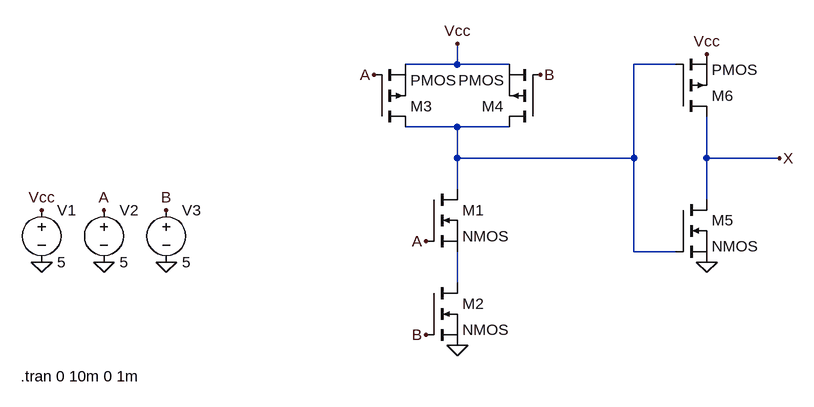
[diagram p0: schematic and.asc]
and.asc, the LTspice schematic file:
Version 4.1
SHEET 1 1056 680
WIRE 528 -128 528 -160
WIRE 528 -128 448 -128
WIRE 608 -128 528 -128
WIRE 864 -128 800 -128
WIRE 528 -32 448 -32
WIRE 608 -32 528 -32
WIRE 528 16 528 -32
WIRE 800 16 800 -128
WIRE 800 16 528 16
WIRE 912 16 912 -48
WIRE 1024 16 912 16
WIRE 528 64 528 16
WIRE 912 80 912 16
WIRE 800 160 800 16
WIRE 864 160 800 160
WIRE 528 208 528 160
FLAG -112 176 0
FLAG -16 176 0
FLAG 80 176 0
FLAG -112 96 Vcc
FLAG -16 96 A
FLAG 80 96 B
FLAG 528 304 0
FLAG 528 -160 Vcc
FLAG 400 -112 A
FLAG 480 144 A
FLAG 480 288 B
FLAG 656 -112 B
FLAG 912 -144 Vcc
FLAG 912 176 0
FLAG 1024 16 X
SYMBOL voltage -112 80 R0
WINDOW 123 0 0 Left 0
WINDOW 39 0 0 Left 0
SYMATTR InstName V1
SYMATTR Value 5
SYMBOL voltage -16 80 R0
WINDOW 123 0 0 Left 0
WINDOW 39 0 0 Left 0
SYMATTR InstName V2
SYMATTR Value 5
SYMBOL voltage 80 80 R0
WINDOW 123 0 0 Left 0
WINDOW 39 0 0 Left 0
SYMATTR InstName V3
SYMATTR Value 5
SYMBOL nmos 480 64 R0
SYMATTR InstName M1
SYMBOL nmos 480 208 R0
SYMATTR InstName M2
SYMBOL pmos 400 -32 M180
SYMATTR InstName M3
SYMBOL pmos 656 -32 R180
SYMATTR InstName M4
SYMBOL nmos 864 80 R0
SYMATTR InstName M5
SYMBOL pmos 864 -48 M180
SYMATTR InstName M6
TEXT -144 352 Left 2 !.tran 0 10m 0 1m

The netlist it stands for:
* and.asc
V1 Vcc 0 5
V2 A 0 5
V3 B 0 5
M1 N001 A N002 N002 NMOS
M2 N002 B 0 0 NMOS
M3 N001 A Vcc Vcc PMOS
M4 N001 B Vcc Vcc PMOS
M5 X N001 0 0 NMOS
M6 X N001 Vcc Vcc PMOS
.model NMOS NMOS
.model PMOS PMOS
.lib standard.mos
.tran 0 10m 0 1m
.backanno
.end